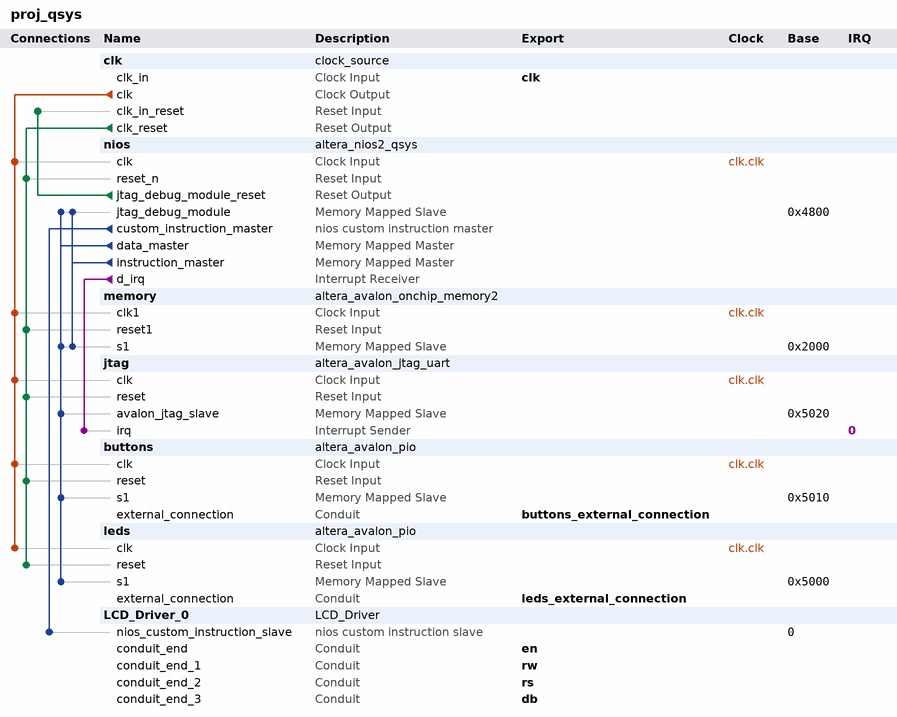
[diagram p0: system contents]
# Platform Designer (Qsys) system proj_qsys, Cyclone IV E EP4CE6E22C8
# Parameters at their usual value, and those the tool derives, are not listed.
package require -exact qsys 13.1
create_system proj_qsys
set_project_property DEVICE_FAMILY {Cyclone IV E}
set_project_property DEVICE EP4CE6E22C8

add_instance clk clock_source 13.1
set_instance_parameter_value clk clockFrequency 50000000

add_instance nios altera_nios2_qsys 13.1
set_instance_parameter_value nios resetSlave memory.s1
set_instance_parameter_value nios mmu_TLBMissExcSlave None
set_instance_parameter_value nios exceptionSlave memory.s1
set_instance_parameter_value nios breakSlave nios.jtag_debug_module
set_instance_parameter_value nios impl Tiny
set_instance_parameter_value nios icache_size 4096

add_instance memory altera_avalon_onchip_memory2 13.1
set_instance_parameter_value memory dataWidth 32
set_instance_parameter_value memory dualPort false
set_instance_parameter_value memory initMemContent true
set_instance_parameter_value memory initializationFileName onchip_mem.hex
set_instance_parameter_value memory memorySize 8192

add_instance jtag altera_avalon_jtag_uart 13.1
set_instance_parameter_value jtag simInteractiveOptions NO_INTERACTIVE_WINDOWS

add_instance buttons altera_avalon_pio 13.1
set_instance_parameter_value buttons direction Input
set_instance_parameter_value buttons width 4

add_instance leds altera_avalon_pio 13.1
set_instance_parameter_value leds direction Output
set_instance_parameter_value leds width 4

add_instance LCD_Driver_0 LCD_Driver 1.0

# connections
add_connection clk.clk buttons.clk clock
add_connection clk.clk jtag.clk clock
add_connection clk.clk leds.clk clock
add_connection clk.clk memory.clk1 clock
add_connection clk.clk nios.clk clock
add_connection clk.clk_reset buttons.reset reset
add_connection clk.clk_reset jtag.reset reset
add_connection clk.clk_reset leds.reset reset
add_connection clk.clk_reset memory.reset1 reset
add_connection clk.clk_reset nios.reset_n reset
add_connection nios.jtag_debug_module_reset clk.clk_in_reset reset
add_connection nios.data_master buttons.s1 avalon
set_connection_parameter_value nios.data_master/buttons.s1 baseAddress 0x5010
add_connection nios.data_master jtag.avalon_jtag_slave avalon
set_connection_parameter_value nios.data_master/jtag.avalon_jtag_slave baseAddress 0x5020
add_connection nios.data_master leds.s1 avalon
set_connection_parameter_value nios.data_master/leds.s1 baseAddress 0x5000
add_connection nios.data_master memory.s1 avalon
set_connection_parameter_value nios.data_master/memory.s1 baseAddress 0x2000
add_connection nios.data_master nios.jtag_debug_module avalon
set_connection_parameter_value nios.data_master/nios.jtag_debug_module baseAddress 0x4800
add_connection nios.instruction_master memory.s1 avalon
set_connection_parameter_value nios.instruction_master/memory.s1 baseAddress 0x2000
add_connection nios.instruction_master nios.jtag_debug_module avalon
set_connection_parameter_value nios.instruction_master/nios.jtag_debug_module baseAddress 0x4800
add_connection nios.d_irq jtag.irq interrupt
set_connection_parameter_value nios.d_irq/jtag.irq irqNumber 0
add_connection nios.custom_instruction_master LCD_Driver_0.nios_custom_instruction_slave nios_custom_instruction
set_connection_parameter_value nios.custom_instruction_master/LCD_Driver_0.nios_custom_instruction_slave CIName lcd_driver_0
set_connection_parameter_value nios.custom_instruction_master/LCD_Driver_0.nios_custom_instruction_slave baseAddress 0

# exported interfaces
add_interface clk clock sink
set_interface_property clk EXPORT_OF clk.clk_in
add_interface buttons_external_connection conduit end
set_interface_property buttons_external_connection EXPORT_OF buttons.external_connection
add_interface leds_external_connection conduit end
set_interface_property leds_external_connection EXPORT_OF leds.external_connection
add_interface en conduit end
set_interface_property en EXPORT_OF LCD_Driver_0.conduit_end
add_interface rw conduit end
set_interface_property rw EXPORT_OF LCD_Driver_0.conduit_end_1
add_interface rs conduit end
set_interface_property rs EXPORT_OF LCD_Driver_0.conduit_end_2
add_interface db conduit end
set_interface_property db EXPORT_OF LCD_Driver_0.conduit_end_3

set_interconnect_requirement {$system} qsys_mm.clockCrossingAdapter HANDSHAKE
set_interconnect_requirement {$system} qsys_mm.maxAdditionalLatency 1
set_interconnect_requirement {$system} qsys_mm.insertDefaultSlave false

save_system proj_qsys.qsys
